# EAGLE schematic Skematic (EAGLE 9.6.2)
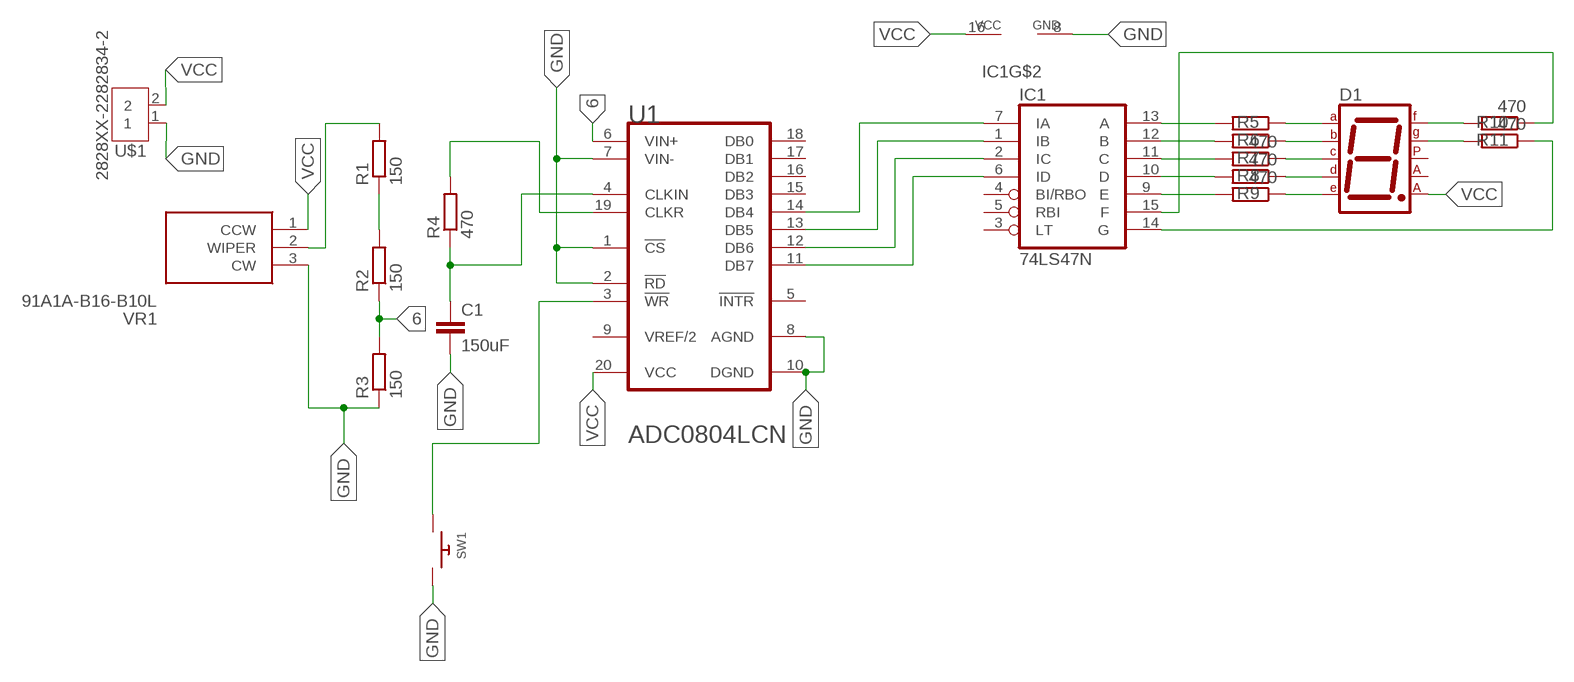
[diagram p0: schematic, sheet 1]

## Parts
C1  150uF  C-EU025-025X050  [C025-025X050]
D1  7SEG-CA  [7SEG-13]
IC1  74LS47N  [DIL16]
R1  150  R-EU_0207/10  [0207/10]
R2  150  R-EU_0207/10  [0207/10]
R3  150  R-EU_0207/10  [0207/10]
R4  470  R-EU_0207/10  [0207/10]
R5  470  R-EU_0207/10  [0207/10]
R6  470  R-EU_0207/10  [0207/10]
R7  470  R-EU_0207/10  [0207/10]
R8  470  R-EU_0207/10  [0207/10]
R9  470  R-EU_0207/10  [0207/10]
R10  470  R-EU_0207/10  [0207/10]
R11  470  R-EU_0207/10  [0207/10]
SW1  SWITCH_PUSHBUTTONEVQ-PE  [TACT_PANA-EVQ]
U1  TI_NATIONAL_SEMICONDUCTOR_ADC0804LCNTI_NATIONAL_SEMICONDUCTOR_ADC0804LCN_0_0  [TI_NATIONAL_SEMICONDUCTOR_ADC0804LCN_0]
U$1  2828XX-2282834-2  [TERMBLK_254-2N]
VR1  91A1A-B16-B10L  [91A1AB16B10L]

## Nets
3: SW1.P$1 U1.3(!WR!)
4: C1.1 R4.1 U1.4(CLKIN)
6: R2.1 R3.2 U1.6(VIN+)
19: R4.2 U1.19(CLKR)
GND: C1.2 IC1.8(GND) R3.1 SW1.P$2 U1.1(!CS!) U1.2(!RD!) U1.7(VIN-) U1.8(AGND) U1.10(DGND) U$1.1 VR1.3(CW)
N$1: R1.1 R2.2
N$2: D1.7(A) R5.1
N$3: D1.6(B) R6.1
N$4: IC1.13(A) R5.2
N$5: D1.4(C) R7.1
N$6: D1.2(D) R8.1
N$7: D1.1(E) R9.1
N$8: D1.9(F) R10.2
N$9: D1.10(G) R11.2
N$10: IC1.12(B) R6.2
N$11: IC1.11(C) R7.2
N$12: IC1.10(D) R8.2
N$13: IC1.9(E) R9.2
N$14: IC1.15(F) R10.1
N$15: IC1.14(G) R11.1
N$16: IC1.7(IA) U1.14(DB4)
N$17: IC1.1(IB) U1.13(DB5)
N$18: IC1.2(IC) U1.12(DB6)
N$19: IC1.6(ID) U1.11(DB7)
OUTPUT: R1.2 VR1.2(WIPER)
VCC: D1.8(CA2) IC1.16(VCC) U1.20(VCC) U$1.2 VR1.1(CCW)
Unconnected: D1.3(CA1) D1.5(DP) IC1.3(LT) IC1.4(BI/RBO) IC1.5(RBI) U1.5(!INTR!) U1.15(DB3) U1.16(DB2) U1.17(DB1) U1.18(DB0)

## Power pins joined to a net without a drawn wire
VREF/2: U1.9(VREF/2)

## Library data of the parts
C1 = rcl:C-EU: CAPACITOR, European symbol; SPICEPREFIX: C
D1 = special:7SEG-CA: 7-segment DISPLAY single anode, 13 mm
IC1 = 74xx-eu:74*47: BCD to seven segment DECODER/DRIVER Source: http://www.ee.washington.edu/stores/DataSheets/74ls/74ls47.pdf
R1-R11 = rcl:R-EU_: RESISTOR, European symbol; SPICEPREFIX: R
SW1 = adafruit:SWITCH_PUSHBUTTON: Buttons SOFTTOUCHSMD_SJ - Soft touch temporary push button (Super Junk Akihabara) Compatible with SKPMANE010 [Mouser: 688-SKPMAN] C&K_KSS = Digikey: KSS221GLFS
U1 = TI National Semiconductor - ADC0804LCN:TI_NATIONAL_SEMICONDUCTOR_ADC0804LCN: CON-ADC-ADC0801LCN; CIIVA_IDS: 1163038; CODE__JEDEC: MS-001-AD; COMPONENT_LINK_1_DESCRIPTION: Datasheet URL; COMPONENT_LINK_1_URL: http://www.ti.com/general/docs/lit/getliterature.tsp?genericPartNumber=ADC0804-N&fileType=pdf; COMP_TYPE: ADC IC; FOOTPRINT_VARIANT_NAME_0: Manufacturer Recommended; IMPORTED: yes; IMPORTED_FROM: vault; IMPORT_TS: 1521842379; MF: TI National Semiconductor; MPN: ADC0804LCN; PACKAGE: NFH0020A; PACKAGE_DESCRIPTION: Molded Dip (N) 20 Lead; PACKAGE_TOP_MARKING: NSUZXYYTTE#*ADC0804LCN; PIN_0_0_18_INSIDE_EDGE: clock; PIN_0_0_3_INSIDE_EDGE: clock; PIN_COUNT: 20; POWER_WISE: N; PREFIX: U; RELEASE_DATE: 1464067589; ROHS: No; VAULT_GUID: D848FCC9-A26A-4FF6-BB6D-9AD3688C050C; VAULT_REVISION: 350B042D-7700-40EA-A6E2-07A44BC48AAE
U$1 = Connector:2828XX-2: 2 Position Wire to Board Terminal Block Horizontal with Board Datasheet <https://www.te.com.cn/commerce/DocumentDelivery/DDEController?Action=showdoc&DocId=Catalog+Section%7F1308389_EUROSTYLE_TERMINAL_BLOCKS%7F0607%7Fpdf%7FEnglish%7FENG_CS_1308389_EUROSTYLE_TERMINAL_BLOCKS_0607.pdf%7F2-282837-5>
VR1 = 91A1A-B16-B10L:91A1A-B16-B10L: BOURNS - 91A1A-B16-B10L - POT, LINEAR, 1K, 1W, 20%, SLOTTED Source: Datasheet <https://www.bourns.com/docs/Product-Datasheets/91_95.pdf>; DESCRIPTION: BOURNS - 91A1A-B16-B10L - POT, LINEAR, 1K, 1W, 20%, SLOTTED; HEIGHT: 17.45mm; MANUFACTURER_NAME: Bourns; MANUFACTURER_PART_NUMBER: 91A1A-B16-B10L; MOUSER_PART_NUMBER: 652-91A1A-B16-B10L; MOUSER_PRICE-STOCK: https://www.mouser.co.uk/ProductDetail/Bourns/91A1A-B16-B10L?qs=1v0N1zrvLE4j7ATJpAiEeQ%3D%3D